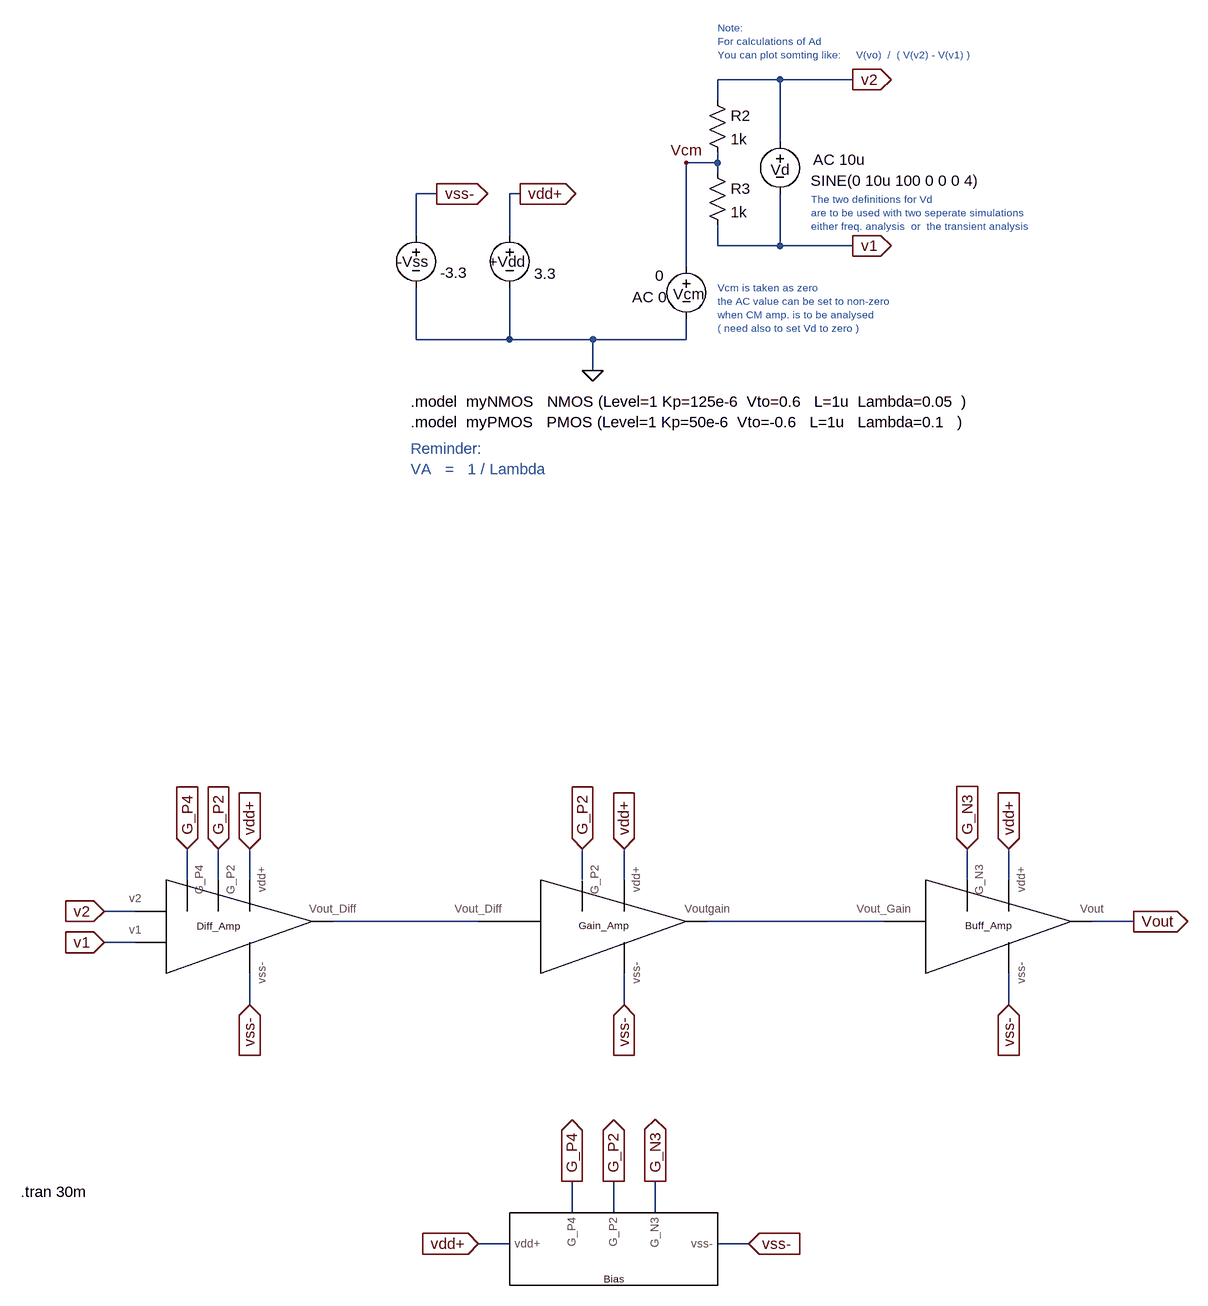
[diagram p0: schematic Final_Ver.asc]
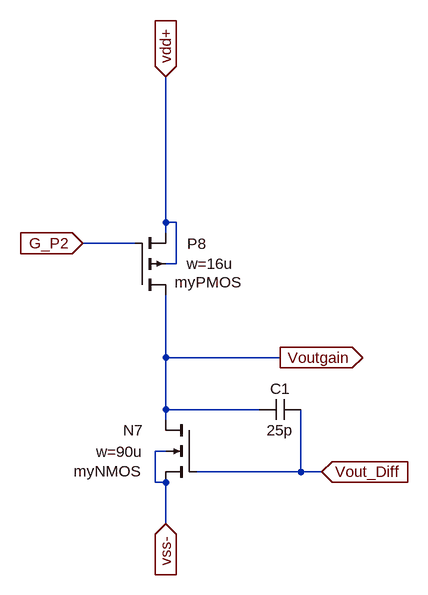
[diagram p1: sub-circuit gain_amplifier.asc]
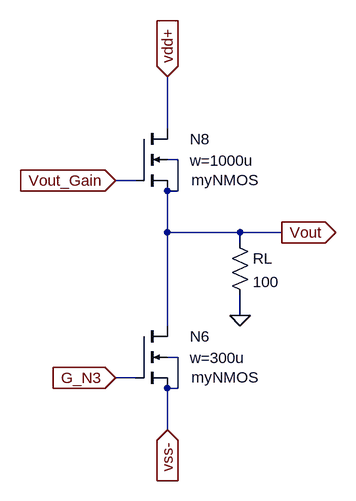
[diagram p2: sub-circuit buffer_amplifier.asc]
Final_Ver.asc, the LTspice schematic file:
Version 4
SHEET 1 2044 1448
WIRE -448 -416 -544 -416
WIRE -336 -416 -448 -416
WIRE -544 -384 -544 -416
WIRE -448 -320 -448 -416
WIRE -544 -288 -544 -304
WIRE -544 -288 -592 -288
WIRE -544 -272 -544 -288
WIRE -976 -240 -1008 -240
WIRE -848 -240 -864 -240
WIRE -1008 -176 -1008 -240
WIRE -864 -176 -864 -240
WIRE -544 -160 -544 -192
WIRE -448 -160 -448 -240
WIRE -448 -160 -544 -160
WIRE -336 -160 -448 -160
WIRE -592 -128 -592 -288
WIRE -1008 -16 -1008 -96
WIRE -864 -16 -864 -96
WIRE -864 -16 -1008 -16
WIRE -736 -16 -864 -16
WIRE -592 -16 -592 -48
WIRE -592 -16 -736 -16
WIRE -736 32 -736 -16
WIRE -1360 816 -1360 768
WIRE -1312 816 -1312 768
WIRE -1264 816 -1264 768
WIRE -752 816 -752 768
WIRE -688 816 -688 768
WIRE -160 816 -160 768
WIRE -96 816 -96 768
WIRE -1440 864 -1488 864
WIRE -912 880 -1136 880
WIRE -288 880 -560 880
WIRE 96 880 32 880
WIRE -1440 912 -1488 912
WIRE -1264 1008 -1264 960
WIRE -688 1008 -688 960
WIRE -96 1008 -96 960
WIRE -768 1328 -768 1280
WIRE -704 1328 -704 1280
WIRE -640 1328 -640 1280
WIRE -864 1376 -912 1376
WIRE -496 1376 -544 1376
FLAG -736 32 0
FLAG -848 -240 vdd+
IOPIN -848 -240 Out
FLAG -976 -240 vss-
IOPIN -976 -240 Out
FLAG -336 -416 v2
IOPIN -336 -416 Out
FLAG -336 -160 v1
IOPIN -336 -160 Out
FLAG -592 -288 Vcm
FLAG -704 1280 G_P2
IOPIN -704 1280 Out
FLAG -768 1280 G_P4
IOPIN -768 1280 Out
FLAG -1360 768 G_P4
IOPIN -1360 768 In
FLAG -1312 768 G_P2
IOPIN -1312 768 In
FLAG -752 768 G_P2
IOPIN -752 768 In
FLAG -160 768 G_N3
IOPIN -160 768 In
FLAG -912 1376 vdd+
IOPIN -912 1376 In
FLAG -1264 768 vdd+
IOPIN -1264 768 In
FLAG -688 768 vdd+
IOPIN -688 768 In
FLAG -96 768 vdd+
IOPIN -96 768 In
FLAG -640 1280 G_N3
IOPIN -640 1280 Out
FLAG -496 1376 vss-
IOPIN -496 1376 In
FLAG -688 1008 vss-
IOPIN -688 1008 In
FLAG -96 1008 vss-
IOPIN -96 1008 In
FLAG -1264 1008 vss-
IOPIN -1264 1008 In
FLAG -1488 864 v2
IOPIN -1488 864 In
FLAG -1488 912 v1
IOPIN -1488 912 In
FLAG 96 880 Vout
IOPIN 96 880 Out
SYMBOL voltage -864 -192 R0
WINDOW 0 -32 56 Left 2
WINDOW 3 38 75 Left 2
WINDOW 123 0 0 Left 0
WINDOW 39 0 0 Left 0
SYMATTR InstName +Vdd
SYMATTR Value 3.3
SYMBOL voltage -1008 -192 R0
WINDOW 0 -29 56 Left 2
WINDOW 3 37 73 Left 2
WINDOW 123 0 0 Left 0
WINDOW 39 0 0 Left 0
SYMATTR InstName -Vss
SYMATTR Value -3.3
SYMBOL voltage -592 -144 R0
WINDOW 0 -20 58 Left 2
WINDOW 3 -48 30 Left 2
WINDOW 123 -83 63 Left 2
WINDOW 39 0 0 Left 0
SYMATTR InstName Vcm
SYMATTR Value 0
SYMATTR Value2 AC 0
SYMBOL voltage -448 -336 R0
WINDOW 0 -14 59 Left 2
WINDOW 3 47 76 Left 2
WINDOW 123 51 43 Left 2
WINDOW 39 0 0 Left 0
SYMATTR InstName Vd
SYMATTR Value SINE(0 10u 100 0 0 0 4)
SYMATTR Value2 AC 10u
SYMBOL res -560 -400 R0
SYMATTR InstName R2
SYMATTR Value 1k
SYMBOL res -560 -288 R0
SYMATTR InstName R3
SYMATTR Value 1k
SYMBOL Bias_Block -672 1376 R0
SYMATTR InstName Bias
SYMBOL Differential_Amplifier -1328 640 R0
SYMATTR InstName Diff_Amp
SYMBOL Gain_Amplifier -704 640 R0
SYMATTR InstName Gain_Amp
SYMBOL Buffer_Amplifier -144 608 R0
SYMATTR InstName Buff_Amp
TEXT -1016 80 Left 2 !.model  myNMOS   NMOS (Level=1 Kp=125e-6  Vto=0.6   L=1u  Lambda=0.05  )\n.model  myPMOS   PMOS (Level=1 Kp=50e-6  Vto=-0.6   L=1u   Lambda=0.1   )
TEXT -1016 152 Left 2 ;Reminder:\nVA   =   1 / Lambda
TEXT -400 -232 Left 1 ;The two definitions for Vd\nare to be used with two seperate simulations\neither freq. analysis  or  the transient analysis
TEXT -544 -96 Left 1 ;Vcm is taken as zero\nthe AC value can be set to non-zero\nwhen CM amp. is to be analysed \n( need also to set Vd to zero )
TEXT -544 -496 Left 1 ;Note: \nFor calculations of Ad\nYou can plot somting like:     V(vo)  /  ( V(v2) - V(v1) )
TEXT -1616 1296 Left 2 !.tran 30m

gain_amplifier.asc, the sub-circuit schematic file:
Version 4
SHEET 1 880 680
WIRE 160 -144 160 -368
WIRE 176 -144 160 -144
WIRE 160 -128 160 -144
WIRE 112 -112 32 -112
WIRE 176 -80 176 -144
WIRE 176 -80 160 -80
WIRE 160 64 160 -32
WIRE 336 64 160 64
WIRE 160 144 160 64
WIRE 304 144 160 144
WIRE 160 160 160 144
WIRE 160 208 144 208
WIRE 368 240 368 144
WIRE 368 240 208 240
WIRE 400 240 368 240
WIRE 144 256 144 208
WIRE 160 256 144 256
WIRE 160 320 160 256
FLAG 400 240 Vout_Diff
IOPIN 400 240 In
FLAG 160 -368 vdd+
IOPIN 160 -368 In
FLAG 336 64 Voutgain
IOPIN 336 64 Out
FLAG 160 320 vss-
IOPIN 160 320 In
FLAG 32 -112 G_P2
IOPIN 32 -112 In
SYMBOL pmos4 112 -32 M180
WINDOW 3 62 20 Left 2
WINDOW 0 81 79 Left 2
WINDOW 123 80 48 Left 2
SYMATTR Value myPMOS
SYMATTR InstName P8
SYMATTR Value2 w=16u
SYMBOL nmos4 208 160 M0
WINDOW 3 85 79 Left 2
WINDOW 0 83 16 Left 2
WINDOW 123 83 49 Left 2
SYMATTR Value myNMOS
SYMATTR InstName N7
SYMATTR Value2 w=90u
SYMBOL cap 368 128 R90
WINDOW 0 0 32 VBottom 2
WINDOW 3 32 32 VTop 2
SYMATTR InstName C1
SYMATTR Value 25p

buffer_amplifier.asc, the sub-circuit schematic file:
Version 4
SHEET 1 880 680
WIRE 160 -128 160 -208
WIRE 176 -80 160 -80
WIRE 112 -48 80 -48
WIRE 176 -32 176 -80
WIRE 176 -32 160 -32
WIRE 160 32 160 -32
WIRE 272 32 160 32
WIRE 336 32 272 32
WIRE 272 48 272 32
WIRE 272 160 272 128
WIRE 160 176 160 32
WIRE 176 224 160 224
WIRE 112 256 80 256
WIRE 176 272 176 224
WIRE 176 272 160 272
WIRE 160 336 160 272
FLAG 160 -208 vdd+
IOPIN 160 -208 In
FLAG 336 32 Vout
IOPIN 336 32 Out
FLAG 272 160 0
FLAG 80 -48 Vout_Gain
IOPIN 80 -48 In
FLAG 80 256 G_N3
IOPIN 80 256 In
FLAG 160 336 vss-
IOPIN 160 336 In
SYMBOL nmos4 112 -128 R0
WINDOW 3 85 79 Left 2
WINDOW 0 83 16 Left 2
WINDOW 123 83 49 Left 2
SYMATTR Value myNMOS
SYMATTR InstName N8
SYMATTR Value2 w=1000u
SYMBOL res 256 32 R0
SYMATTR InstName RL
SYMATTR Value 100
SYMBOL nmos4 112 176 R0
WINDOW 3 85 79 Left 2
WINDOW 0 83 16 Left 2
WINDOW 123 83 49 Left 2
SYMATTR Value myNMOS
SYMATTR InstName N6
SYMATTR Value2 w=300u

The netlist it stands for:
* Final_Ver.asc
V§+Vdd vdd+ 0 3.3
V§-Vss vss- 0 -3.3
Vcm Vcm 0 0 AC 0
Vd v2 v1 SINE(0 10u 100 0 0 0 4) AC 10u
R2 v2 Vcm 1k
R3 Vcm v1 1k
XBias vdd+ vss- G_N3 G_P2 G_P4 Bias_Block  ; pins vdd+ vss- G_N3 G_P2 G_P4
XDiff_Amp G_P2 G_P4 v1 v2 vdd+ vss- N001 Differential_Amplifier  ; pins G_P2 G_P4 v1 v2 vdd+ vss- Vout_Diff
XGain_Amp G_P2 vdd+ N001 vss- N002 gain_amplifier
XBuff_Amp G_N3 vdd+ N002 vss- Vout buffer_amplifier

* block symbol definitions
.subckt gain_amplifier G_P2 vdd+ Vout_Diff vss- Voutgain
M§P8 Voutgain G_P2 vdd+ vdd+ myPMOS w=16u
M§N7 Voutgain Vout_Diff vss- vss- myNMOS w=90u
C1 Vout_Diff Voutgain 25p
.ends gain_amplifier

.subckt buffer_amplifier G_N3 vdd+ Vout_Gain vss- Vout
M§N8 vdd+ Vout_Gain Vout Vout myNMOS w=1000u
RL Vout 0 100
M§N6 Vout G_N3 vss- vss- myNMOS w=300u
.ends buffer_amplifier

.model NMOS NMOS
.model PMOS PMOS
.lib standard.mos
.model  myNMOS   NMOS (Level=1 Kp=125e-6  Vto=0.6   L=1u  Lambda=0.05  )
.model  myPMOS   PMOS (Level=1 Kp=50e-6  Vto=-0.6   L=1u   Lambda=0.1   )
* Reminder:
* VA   =   1 / Lambda
* The two definitions for Vd
* are to be used with two seperate simulations
* either freq. analysis  or  the transient analysis
* Vcm is taken as zero
* the AC value can be set to non-zero
* when CM amp. is to be analysed
* ( need also to set Vd to zero )
* Note:
* For calculations of Ad
* You can plot somting like:     V(vo)  /  ( V(v2) - V(v1) )
.tran 30m
.backanno
.end